# Altium schematic sheet STM32F030F4P6_2021-01-15.schdoc
size 72 x 62 mm
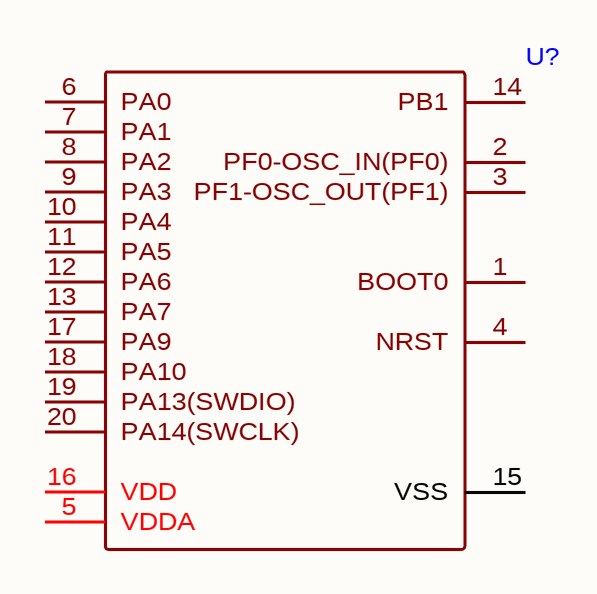
[diagram p0: STM32F030F4P6_2021-01-15.schdoc]

## Parts
U?  (no value)  [TSSOP-20_L6.5-W4.4-P0.65-LS6.4-BL]

## Nets

Not connected (* = marked no-connect by the designer): U? 1(BOOT0) 2(PF0-OSC_IN(PF0)) 3(PF1-OSC_OUT(PF1)) 4(NRST) 5(VDDA) 6(PA0) 7(PA1) 8(PA2) 9(PA3) 10(PA4) 11(PA5) 12(PA6) 13(PA7) 14(PB1) 15(VSS) 16(VDD) 17(PA9) 18(PA10) 19(PA13(SWDIO)) 20(PA14(SWCLK))

## Library data of the parts
U? = STM32F030F4P6